# Altium schematic sheet Peripherals.SchDoc: Peripherals
size A; Author: Craig Hesling; DrawnBy: Craig Hesling; Revision: 1
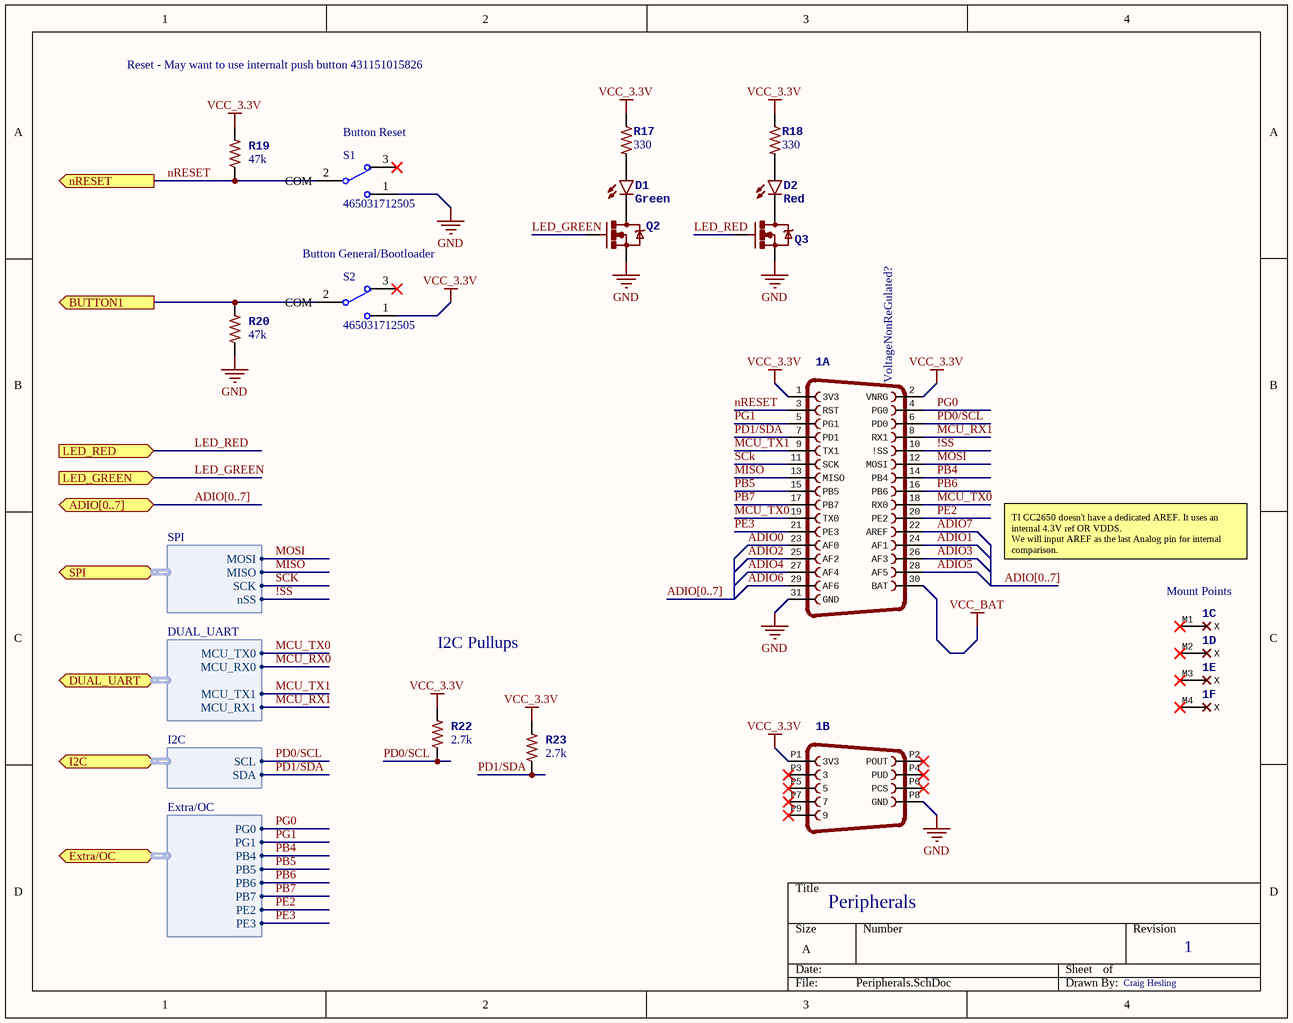
[diagram p0: Peripherals.SchDoc]

## Parts
1  Addon Board for Firefly Sensor Nodes    This version is compliant with Firefly Micro powered by Atmel Atmega128RFA1.    Connectors on female gender match those on Firefly Micro Board.    Connectors on male gender mate with Firefly Micro Board. Use these for addons.  [FIREFLY_MICRO_BOARD]  (value not drawn)  (parts A,B,C,D,E,F of 6)
D1  Green  [LED-0603]
D2  Red  [LED-0603]
Q2  Common NMOSFET Parts      MFG P/NStore IDProd ID   FDD8780		TRANS-09984	   SI7820DN		TRANS-11055	   FDS6630A		IC-08089	   2N7002PW		TRANS-11151	   FQP30N06L	  COM-10213	TRANS-10060	   BSS123LT1G		TRANS-08345	   BSS138		TRANS-00830	   BS170			   2N7000  [SOT23-3]  (value not drawn)
Q3  Common NMOSFET Parts      MFG P/NStore IDProd ID   FDD8780		TRANS-09984	   SI7820DN		TRANS-11055	   FDS6630A		IC-08089	   2N7002PW		TRANS-11151	   FQP30N06L	  COM-10213	TRANS-10060	   BSS123LT1G		TRANS-08345	   BSS138		TRANS-00830	   BS170			   2N7000  [SOT23-3]  (value not drawn)
R17  value 330  [0603-RES]  (hidden comment: RES-00818)
R18  value 330  [0603-RES]  (hidden comment: RES-00818)
R19  value 47k  [0603-RES]  (hidden comment: RES-00824)
R20  value 47k  [0603-RES]  (hidden comment: RES-00824)
R22  value 2.7k  [0603-RES]  (hidden comment: RES-00824)
R23  value 2.7k  [0603-RES]  (hidden comment: RES-00824)
S1  465031712505  [465031712505]
S2  465031712505  [465031712505]

## Ports
ADIO[0..7] (bidir), BUTTON1 (out), DUAL_UART (harness DUAL_UART), Extra/OC (harness Extra/OC), I2C (harness I2C), LED_GREEN (in), LED_RED (in), nRESET (out), SPI (harness SPI)

## Harnesses
SPI: MOSI, MISO, SCK, nSS
DUAL_UART: MCU_TX0, MCU_RX0, MCU_TX1, MCU_RX1
I2C: SCL, SDA
Extra/OC: PG0, PG1, PB4, PB6, PB5, PB7, PE2, PE3

## Nets
GND: 1.31(GND) 1.P8(GND) Q2.2(S) Q3.2(S) R20.1 S1.1
VCC_3.3V: 1.1(3V3) 1.2(VNRG) 1.P1(3V3) R17.1 R18.1 R19.2 R22.2 R23.2 S2.1
VCC_BAT: 1.30(BAT)
!SS: 1.10(!SS) ; port SPI.nSS
ADIO0: 1.23(AF0)
ADIO1: 1.24(AF1)
ADIO2: 1.25(AF2)
ADIO3: 1.26(AF3)
ADIO4: 1.27(AF4)
ADIO5: 1.28(AF5)
ADIO6: 1.29(AF6)
ADIO7: 1.22(AREF)
BUTTON1: R20.2 S2.2(COM) ; port BUTTON1
LED_GREEN: Q2.1(G) ; port LED_GREEN
LED_RED: Q3.1(G) ; port LED_RED
MCU_RX0: port DUAL_UART.MCU_RX0
MCU_RX1: 1.8(RX1) ; port DUAL_UART.MCU_RX1
MCU_TX0: 1.18(RX0) 1.19(TX0) ; port DUAL_UART.MCU_TX0
MCU_TX1: 1.9(TX1) ; port DUAL_UART.MCU_TX1
MISO: 1.13(MISO) ; port SPI.MISO
MOSI: 1.12(MOSI) ; port SPI.MOSI
nRESET: 1.3(RST) R19.1 S1.2(COM) ; port nRESET
PB4: 1.14(PB4) ; port Extra/OC.PB4
PB5: 1.15(PB5) ; port Extra/OC.PB5
PB6: 1.16(PB6) ; port Extra/OC.PB6
PB7: 1.17(PB7) ; port Extra/OC.PB7
PD0/SCL: 1.6(PD0) R22.1 ; port I2C.SCL
PD1/SDA: 1.7(PD1) R23.1 ; port I2C.SDA
PE2: 1.20(PE2) ; port Extra/OC.PE2
PE3: 1.21(PE3) ; port Extra/OC.PE3
PG0: 1.4(PG0) ; port Extra/OC.PG0
PG1: 1.5(PG1) ; port Extra/OC.PG1
SCK: 1.11(SCK) ; port SPI.SCK
NetD1_A: D1.A R17.2
NetD1_C: D1.C Q2.3(D)
NetD2_A: D2.A R18.2
NetD2_C: D2.C Q3.3(D)

Not connected (* = marked no-connect by the designer): 1 M1(X)* M2(X)* M3(X)* M4(X)* P2(POUT)* P3(3)* P4(PUD)* P5(5)* P6(PCS)* P7(7)* P9(9)*; S1 3*; S2 3*

## Buses and harness runs
bus ADIO[0..7]
bus ADIO[0..7] = port ADIO[0..7]

## Notes on the sheet
- Reset - May want to use internalt push button 431151015826
- (near S1) Button Reset
- (near S2) Button General/Bootloader
- (near 1) VoltageNonReGulated?
- TI CC2650 doesn't have a dedicated AREF. It uses an internal 4.3V ref OR VDDS.
  We will input AREF as the last Analog pin for internal comparison.
- (near 1) Mount Points
- I2C Pullups

## Library data of the parts
1 = FIREFLY_MICRO_BOARD: GENDER: Female
D1 = LED-GREEN0603: PROD_ID: DIO-00821
D2 = LED-RED0603: PROD_ID: DIO-00819
Q2 Q3 = MOSFET-NCHANNELBSS138: PROD_ID: TRANS-00830
R17 R18 = 330OHM1/10W1%(0603): PROD_ID: RES-00818
R19 R20 R22 R23 = 10KOHM-1/10W-1%(0603)0603: PROD_ID: RES-00824
S1 S2 = WS-PBSU, 465031712505: WS-PBSU 9.8 x 18.5 mm SMD side push; Manufacturer: Wurth Elektronik; ComponentLink1 Description: Manufacturer; ComponentLink2 Description: Datasheet; Created Date: Dec.2015; Part No.: 465031712505; ComponentLink1URL: http://www.we-online.com; ComponentLink2URL: http://katalog.we-online.de/em/datasheet/465031712505.pdf; Created by: Baojun Chen